# Altium schematic sheet 6DOF.schdoc
size 249 x 130 mm
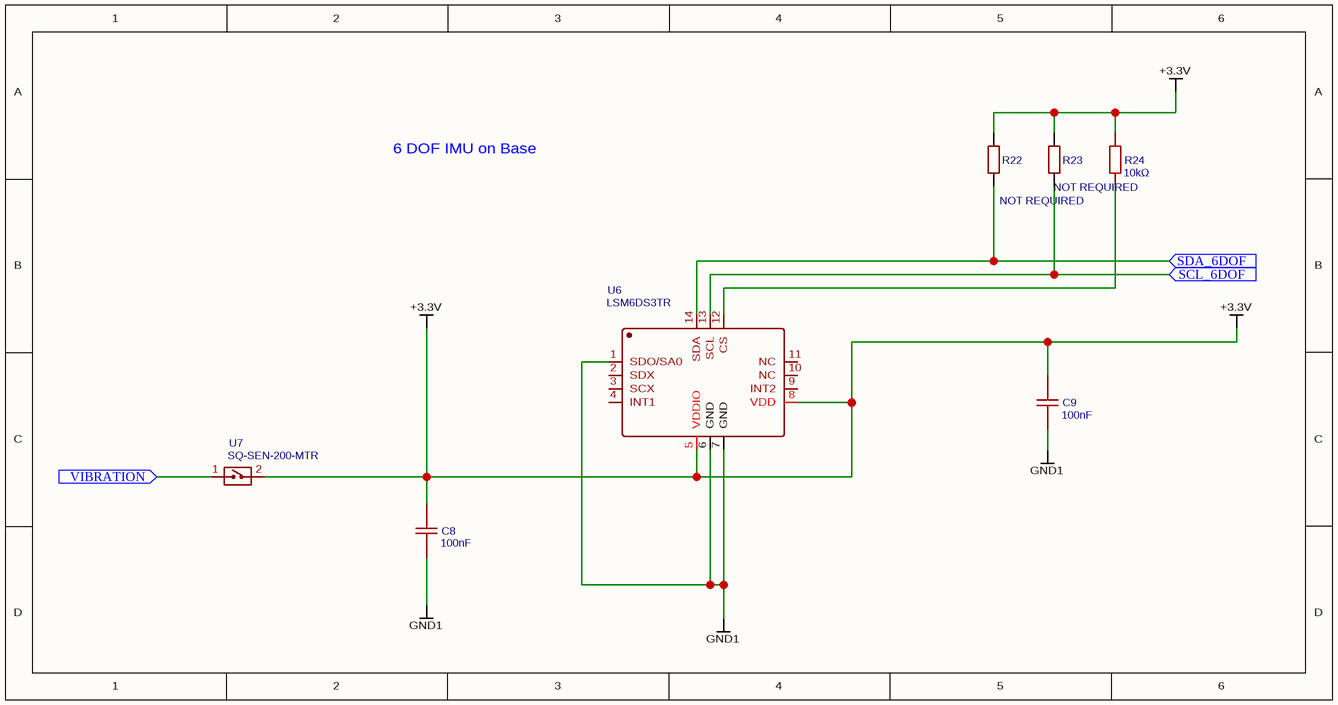
[diagram p0: 6DOF.schdoc]

## Parts
C8  100nF  [C0805]
C9  100nF  [C0805]
R22  NOT REQUIRED  [R0805]
R23  NOT REQUIRED  [R0805]
R24  10kΩ  [R0805]
U6  LSM6DS3TR  [LGA-14_L3.0-W2.5-P0.50-TL]
U7  SQ-SEN-200-MTR  [SW-SMD_SQ-SEN-200-MTR]

## Ports
SCL_6DOF (in), SDA_6DOF (in), VIBRATION (in)

## Nets
+3.3V: C8.2 C9.2 R22.2 R23.2 R24.2 U6.5(VDDIO) U6.8(VDD) U7.2
GND1: C8.1 C9.1 U6.1(SDO/SA0) U6.6(GND) U6.7(GND)
SCL_6DOF: R23.1 U6.13(SCL) ; port SCL_6DOF
SDA_6DOF: R22.1 U6.14(SDA) ; port SDA_6DOF
VIBRATION: U7.1 ; port VIBRATION
NetR24_1: R24.1 U6.12(CS)

Not connected (* = marked no-connect by the designer): U6 2(SDX) 3(SCX) 4(INT1) 9(INT2) 10(NC) 11(NC)

## Notes on the sheet
- 6 DOF IMU on Base

## Library data of the parts
C8 C9 = 100nF: BOM_Manufacturer: YAGEO; BOM_Manufacturer Part: CC0805KRX7R8BB104; nameAlias: Capacitance; Contributor: LCSC; BOM_Supplier: LCSC; BOM_Supplier Part: C519981; BOM_JLCPCB Part Class: Extended Part; spicePre: C; spiceSymbolName: CC0805KRX7R8BB104
R22 R23 = NOT REQUIRED: BOM_Manufacturer: UniOhm; BOM_Manufacturer Part: 0805W8J0472T5E; nameAlias: Resistance; Resistance (Ohms): 4.7K; BOM_Supplier: LCSC; BOM_Supplier Part: C26022; BOM_JLCPCB Part Class: Extended Part; spicePre: R; spiceSymbolName: 0805W8J0472T5E
R24 = 10kΩ: BOM_Manufacturer: Ever Ohms Tech; BOM_Manufacturer Part: TR0805D10KP0550; Resistance (Ohms): 10K; nameAlias: Resistance; Contributor: LCSC; BOM_Supplier: LCSC; BOM_Supplier Part: C332266; BOM_JLCPCB Part Class: Extended Part; spicePre: R; spiceSymbolName: TR0805D10KP0550
U6 = LSM6DS3TR: BOM_Manufacturer: STMicroelectronics; Contributor: LCSC; BOM_Supplier: LCSC; BOM_Supplier Part: C95230; BOM_Manufacturer Part: LSM6DS3TR; BOM_JLCPCB Part Class: Extended Part; spicePre: U; spiceSymbolName: LSM6DS3TR
U7 = SQ-SEN-200-MTR: BOM_Manufacturer: SignalQuest; Contributor: LCSC; BOM_Supplier: LCSC; BOM_Supplier Part: C2687703; BOM_Manufacturer Part: SQ-SEN-200-MTR; BOM_JLCPCB Part Class: Extended Part; spicePre: U; spiceSymbolName: SQ-SEN-200-MTR